# Altium project MAIN_BOARD.PrjPcb (part 2 of 3)

## Sheet RAIL_DISCHARGE.SchDoc
size A4; SheetNumber: 9; SheetTotal: 10
Used 3 times, as channels RAIL_DISCH_0, RAIL_DISCH_1, RAIL_DISCH_2. Parts and nets are listed once, with the designators drawn on the sheet.
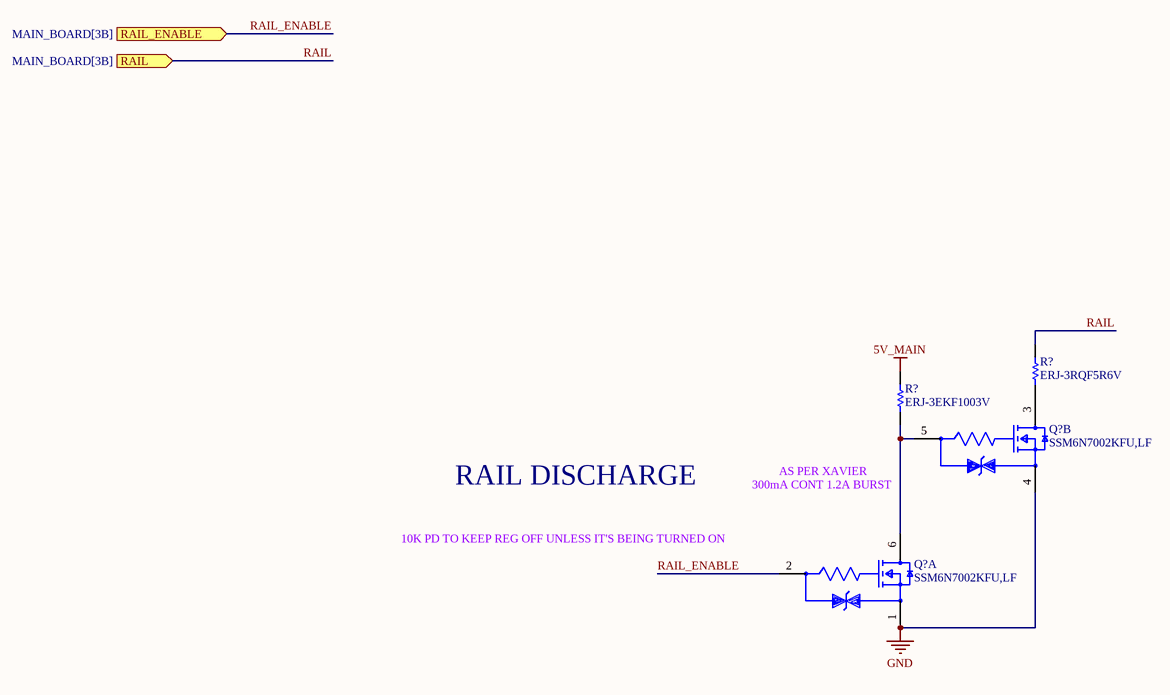
[diagram p11: RAIL_DISCHARGE.SchDoc]

### Parts
(Parts that share a designator on the sheet are numbered #1, #2 ... from top to bottom, then left to right.)
Q?#1  SSM6N7002KFU,LF  [FP-SSOP6-P-0_65A-MFG]  (part B of 2)
Q?#2  SSM6N7002KFU,LF  [FP-SSOP6-P-0_65A-MFG]  (part A of 2)
R?#1  ERJ-3RQF5R6V  [RESC1608X55X30LL15T15]
R?#2  ERJ-3EKF1003V  [RESC1608X55X30ML15T15]

### Ports
RAIL (in, see MAIN_BOARD[3B]), RAIL_ENABLE (in, see MAIN_BOARD[3B])

### Nets
5V_MAIN: R?#2.2
GND: Q?#1.4(Source2) Q?#2.1(Source1)
RAIL: R?#1.2 ; port RAIL
RAIL_ENABLE: Q?#2.2(Gate1) ; port RAIL_ENABLE
NetQ?#1_3: Q?#1.3(Drain2) R?#1.1
NetQ?#1_5: Q?#1.5(Gate2) Q?#2.6(Drain1) R?#2.1

### Channels
RAIL_DISCH_0: designators Q?=Q?_RAIL_DISCH_0#2 Q?=Q?_RAIL_DISCH_0#1 R?=R?_RAIL_DISCH_0#2 R?=R?_RAIL_DISCH_0#1; ports RAIL=RAIL_RAIL_DISCH_0 RAIL_ENABLE=RAIL_ENABLE_RAIL_DISCH_0
RAIL_DISCH_1: designators Q?=Q?_RAIL_DISCH_1#2 Q?=Q?_RAIL_DISCH_1#1 R?=R?_RAIL_DISCH_1#2 R?=R?_RAIL_DISCH_1#1; ports RAIL=RAIL RAIL_ENABLE=RAIL_ENABLE_RAIL_DISCH_1
RAIL_DISCH_2: designators Q?=Q?_RAIL_DISCH_2#2 Q?=Q?_RAIL_DISCH_2#1 R?=R?_RAIL_DISCH_2#2 R?=R?_RAIL_DISCH_2#1; ports RAIL=RAIL RAIL_ENABLE=RAIL_ENABLE_RAIL_DISCH_2

### Notes on the sheet
- RAIL DISCHARGE
- 300mA CONT 1.2A BURST
- AS PER XAVIER
- 10K PD TO KEEP REG OFF UNLESS IT'S BEING TURNED ON

### Library data of the parts
Q?#1 Q?#2 = CMP-35916-000009-1: MOSFET 2N-CH 60V 0.3A; Input Capacitance: 40pF; Continuous Drain Current (ID): 300mA; Max Power Dissipation: 285mW; FET Type: 2 N-Channel; Rds On Max: 1.5R; Mount: Surface Mount; Drain to Source Voltage (Vdss): 60V; Packaging: Tape and Reel
R?#1 = CMP-2000-00850-1: Manufacturer: Panasonic; Part Number: ERJ-3RQF5R6V
R?#2 = CMP-2000-00182-1: Manufacturer: Panasonic; Part Number: ERJ-3EKF1003V

## Sheet GMSL_DESERIALIZER.SchDoc
size C; SheetNumber: 6; SheetTotal: 11
Used 2 times, as channels DES_1, DES_0. Parts and nets are listed once, with the designators drawn on the sheet.
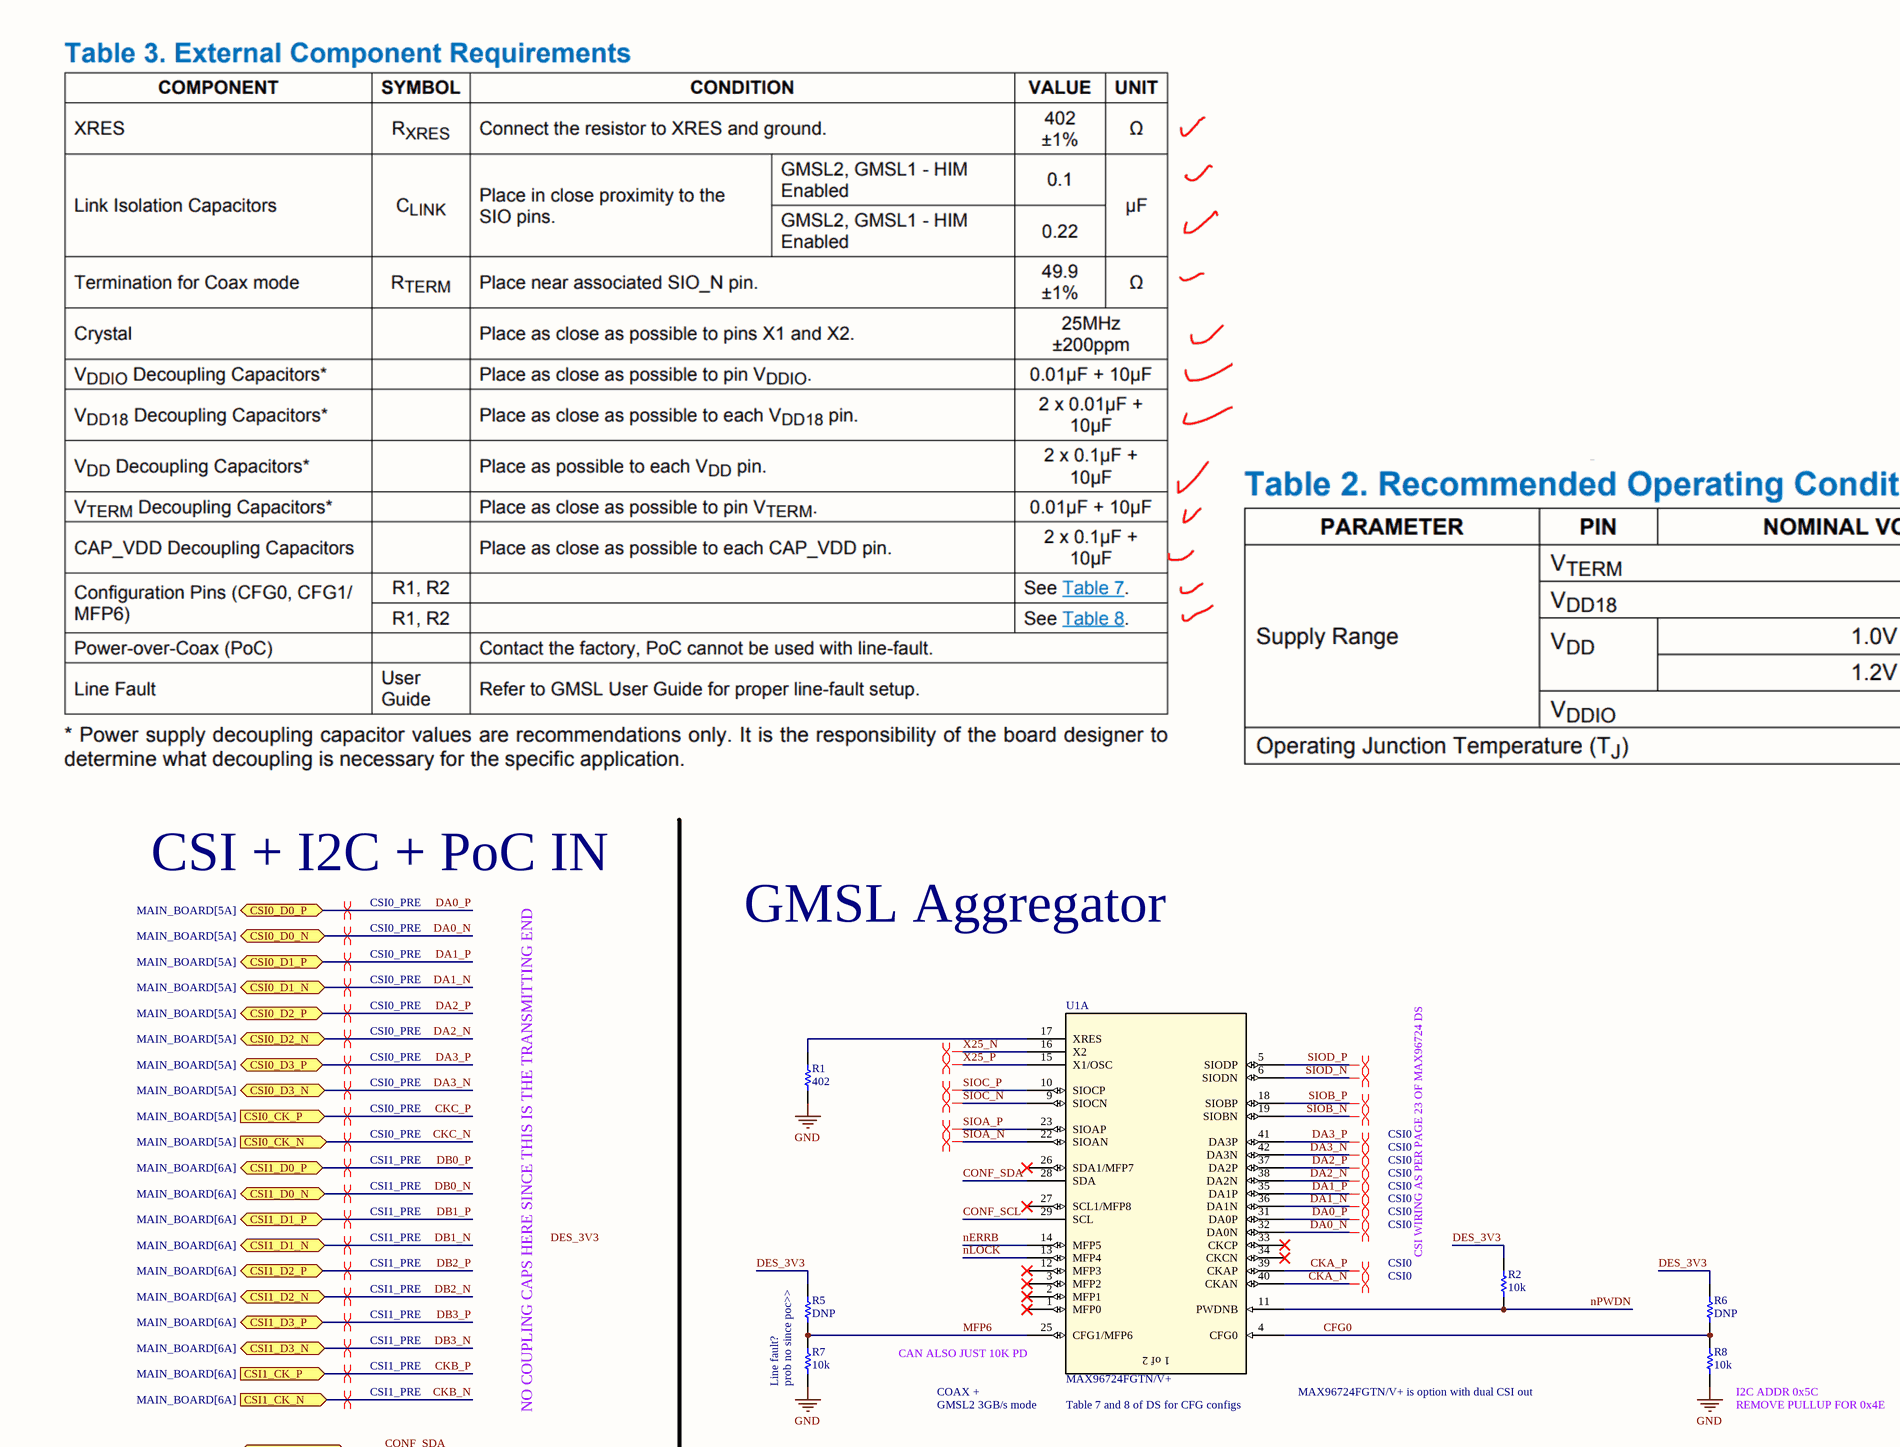
[diagram p12: GMSL_DESERIALIZER.SchDoc, top left]
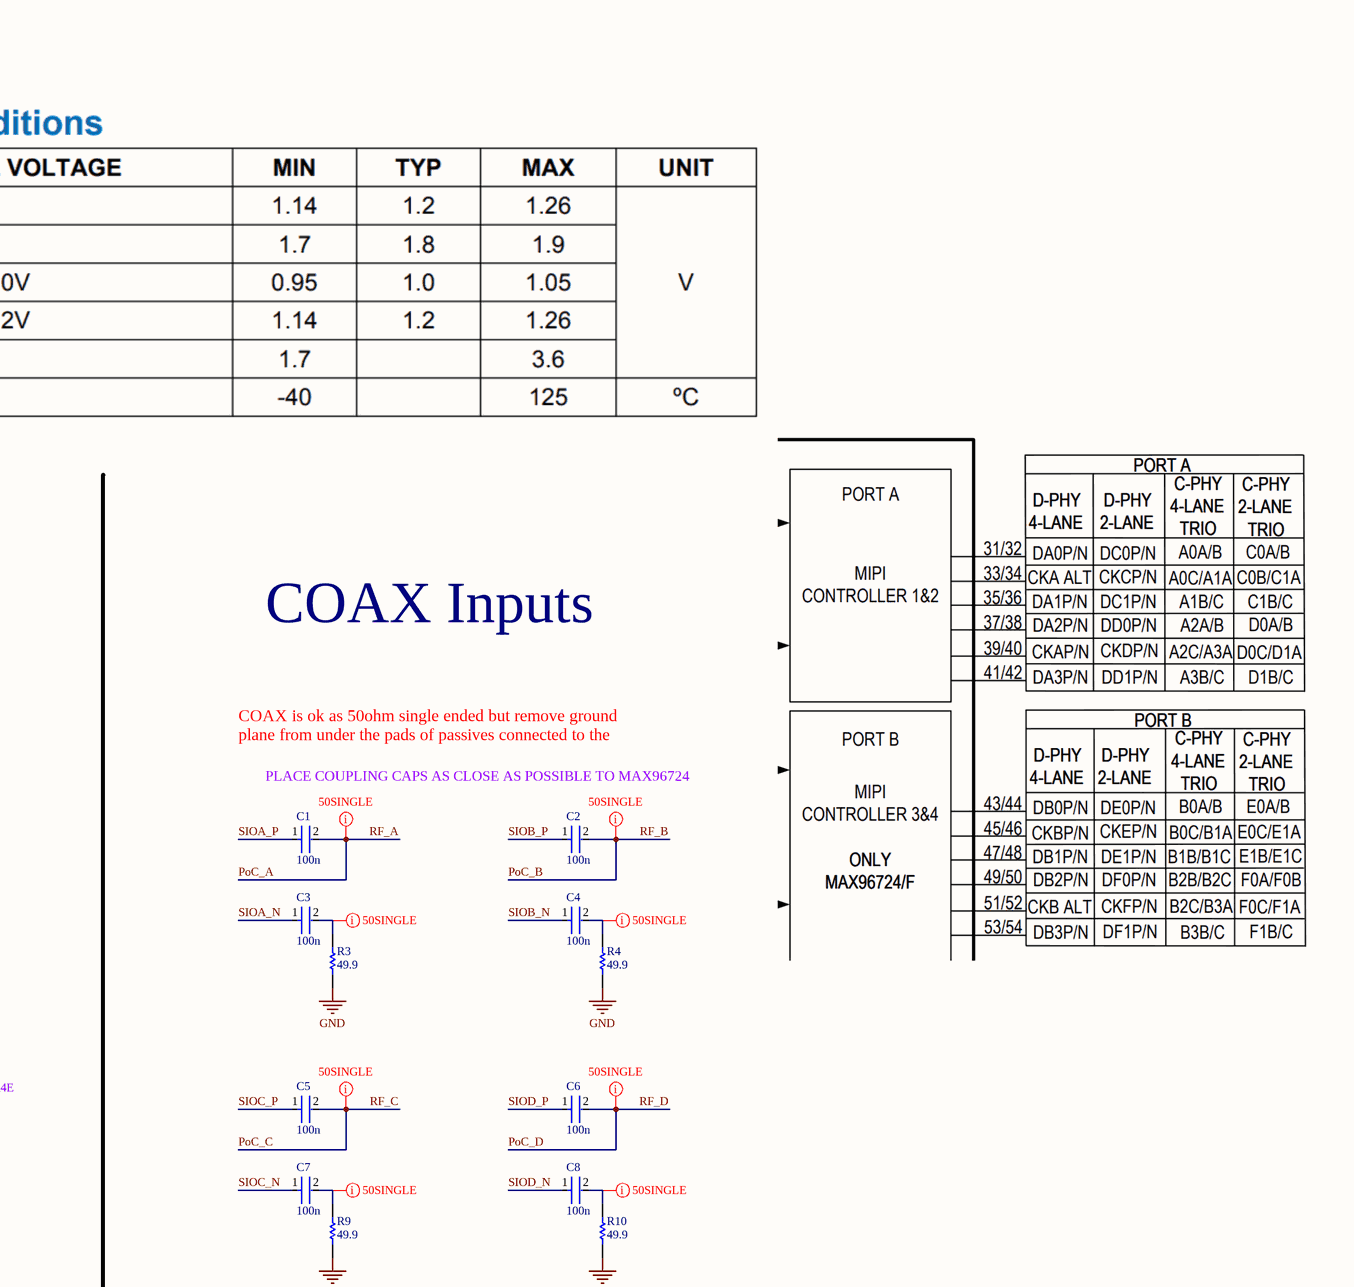
[diagram p13: GMSL_DESERIALIZER.SchDoc, top right]
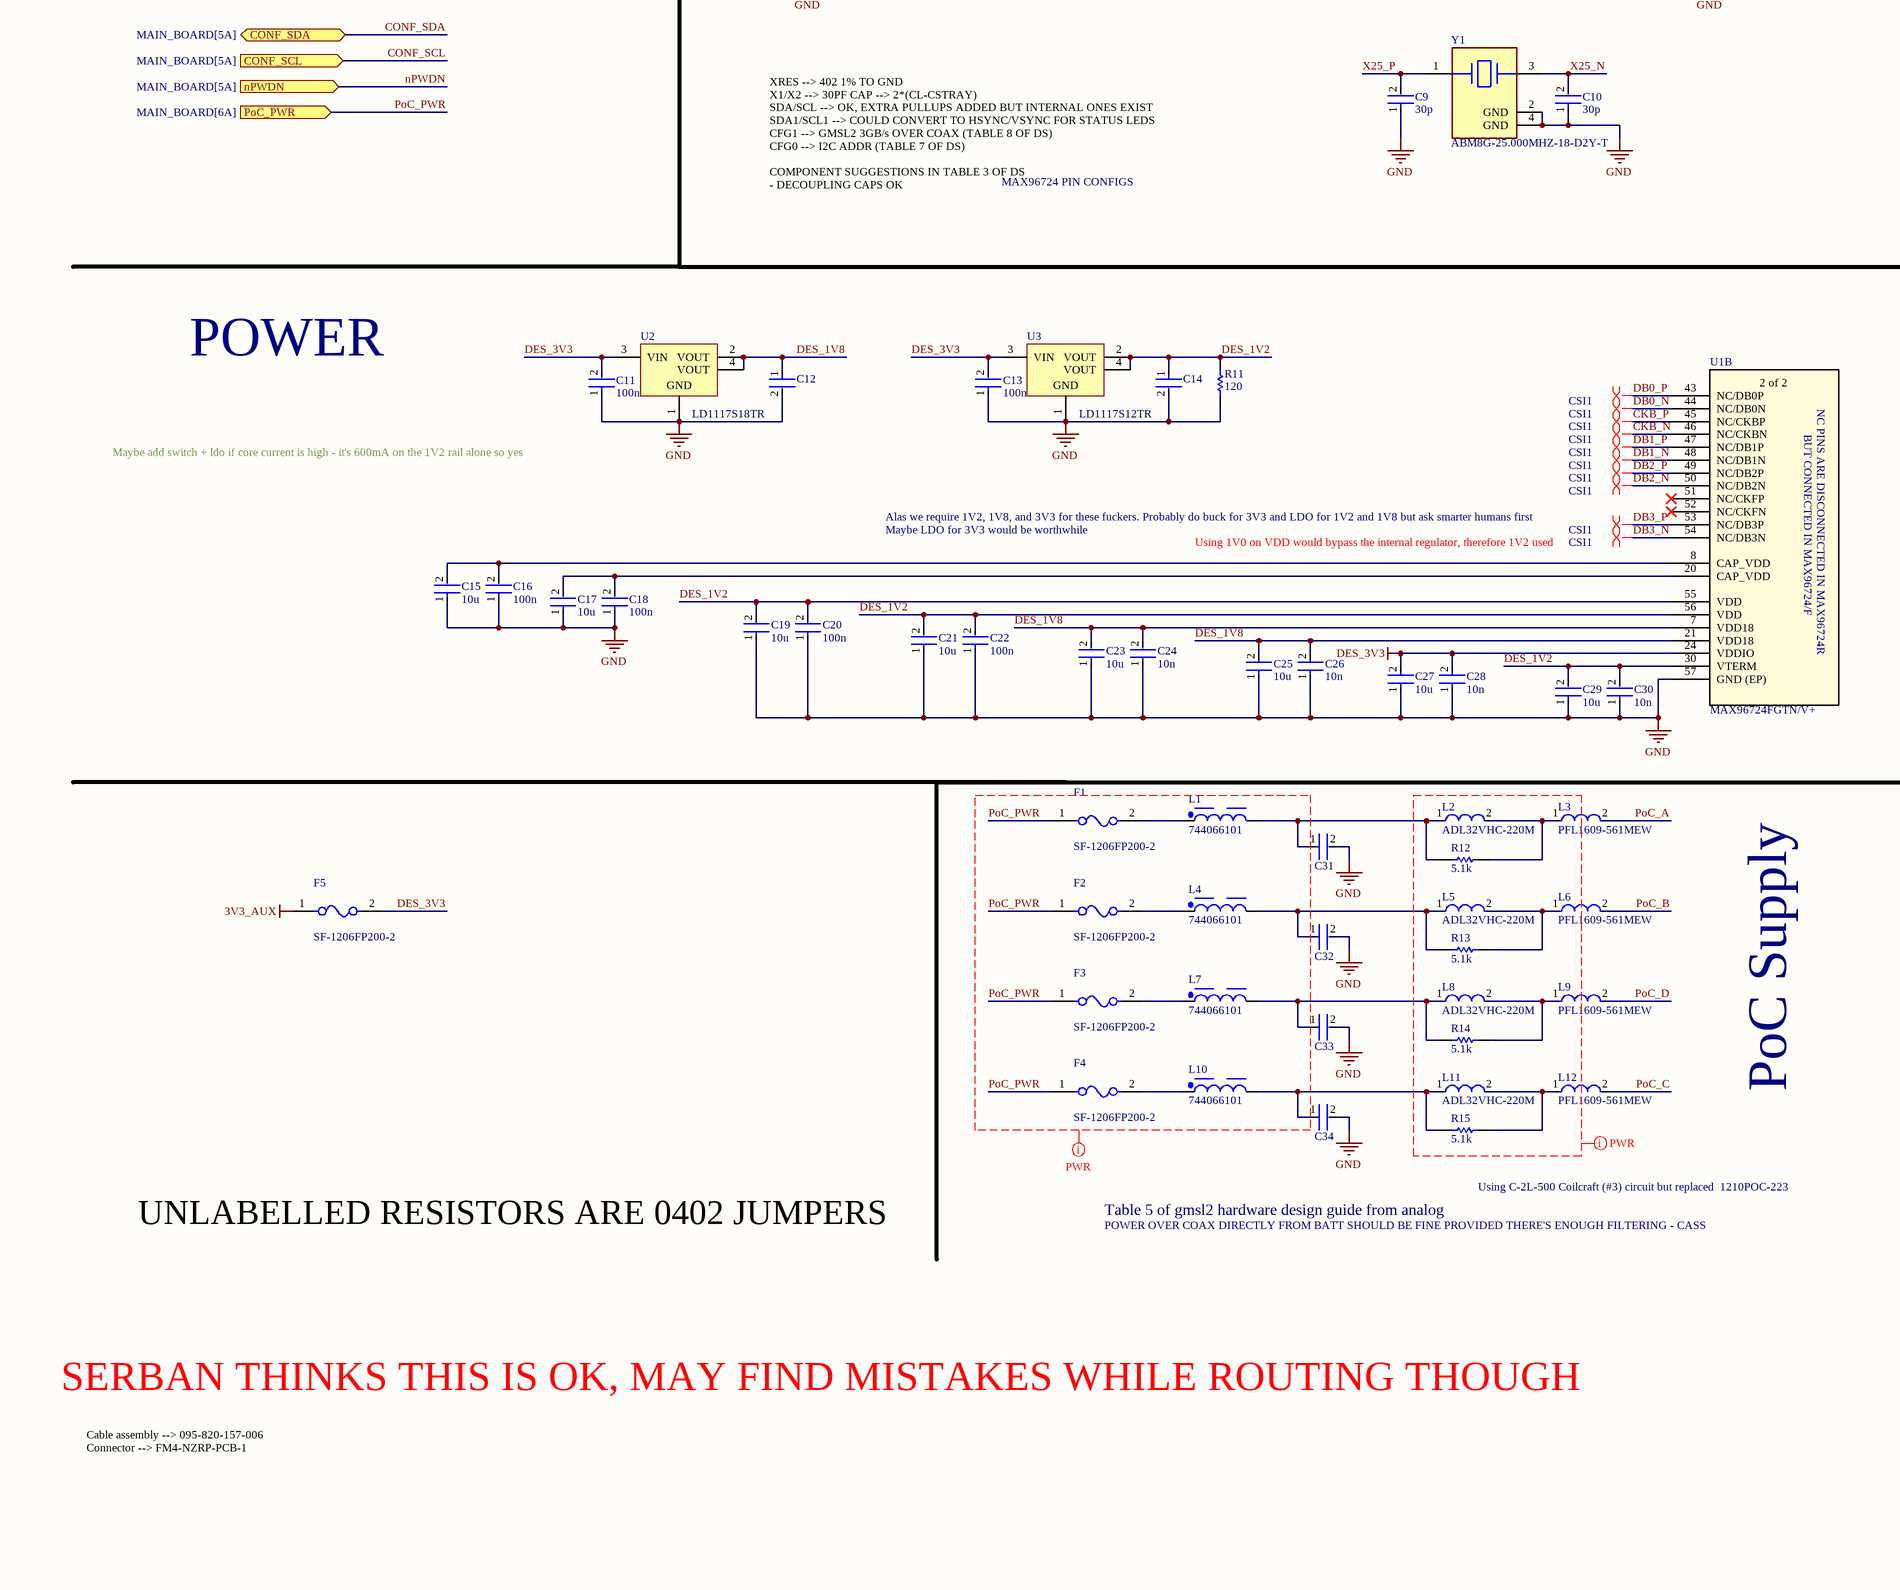
[diagram p14: GMSL_DESERIALIZER.SchDoc, bottom left]
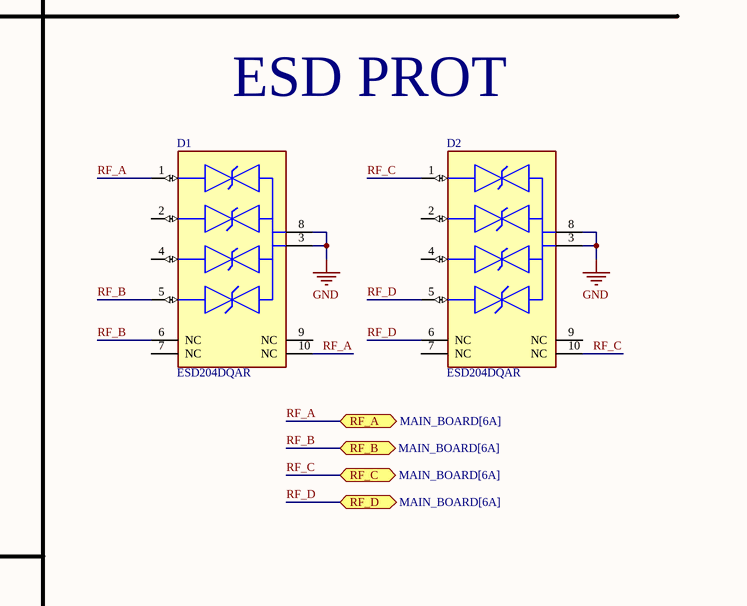
[diagram p15: GMSL_DESERIALIZER.SchDoc, bottom right]

### Parts
C1  100n  [FP-0402-L_1_0_0_05-W_0_5-IPC_A]
C2  100n  [FP-0402-L_1_0_0_05-W_0_5-IPC_A]
C3  100n  [FP-0402-L_1_0_0_05-W_0_5-IPC_A]
C4  100n  [FP-0402-L_1_0_0_05-W_0_5-IPC_A]
C5  100n  [FP-0402-L_1_0_0_05-W_0_5-IPC_A]
C6  100n  [FP-0402-L_1_0_0_05-W_0_5-IPC_A]
C7  100n  [FP-0402-L_1_0_0_05-W_0_5-IPC_A]
C8  100n  [FP-0402-L_1_0_0_05-W_0_5-IPC_A]
C9  30p  [FP-0402-L_1_0_0_05-W_0_5-IPC_A]
C10  30p  [FP-0402-L_1_0_0_05-W_0_5-IPC_A]
C11  100n  [FP-0402-L_1_0_0_05-W_0_5-IPC_A]
C12  GRM188R60J106ME47D  [FP-GRM188-0_1-e0_2_0_55-IPC_A]  (value not drawn)
C13  100n  [FP-0402-L_1_0_0_05-W_0_5-IPC_A]
C14  GRM188R60J106ME47D  [FP-GRM188-0_1-e0_2_0_55-IPC_A]  (value not drawn)
C15  10u  [FP-0402-L_1_0_0_05-W_0_5-IPC_A]
C16  100n  [FP-0402-L_1_0_0_05-W_0_5-IPC_A]
C17  10u  [FP-0402-L_1_0_0_05-W_0_5-IPC_A]
C18  100n  [FP-0402-L_1_0_0_05-W_0_5-IPC_A]
C19  10u  [FP-0402-L_1_0_0_05-W_0_5-IPC_A]
C20  100n  [FP-0402-L_1_0_0_05-W_0_5-IPC_A]
C21  10u  [FP-0402-L_1_0_0_05-W_0_5-IPC_A]
C22  100n  [FP-0402-L_1_0_0_05-W_0_5-IPC_A]
C23  10u  [FP-0402-L_1_0_0_05-W_0_5-IPC_A]
C24  10n  [FP-0402-L_1_0_0_05-W_0_5-IPC_A]
C25  10u  [FP-0402-L_1_0_0_05-W_0_5-IPC_A]
C26  10n  [FP-0402-L_1_0_0_05-W_0_5-IPC_A]
C27  10u  [FP-0402-L_1_0_0_05-W_0_5-IPC_A]
C28  10n  [FP-0402-L_1_0_0_05-W_0_5-IPC_A]
C29  10u  [FP-0402-L_1_0_0_05-W_0_5-IPC_A]
C30  10n  [FP-0402-L_1_0_0_05-W_0_5-IPC_A]
C31  GRM21BR61E226ME44L  [FP-GRM21B-0_2-e0_2_0_7-IPC_B]  (value not drawn)
C32  GRM21BR61E226ME44L  [FP-GRM21B-0_2-e0_2_0_7-IPC_B]  (value not drawn)
C33  GRM21BR61E226ME44L  [FP-GRM21B-0_2-e0_2_0_7-IPC_B]  (value not drawn)
C34  GRM21BR61E226ME44L  [FP-GRM21B-0_2-e0_2_0_7-IPC_B]  (value not drawn)
D1  ESD204DQAR  [FP-DQA0010A-MFG]
D2  ESD204DQAR  [FP-DQA0010A-MFG]
F1  SF-1206FP200-2  [FP-SF-1206FP-MFG]
F2  SF-1206FP200-2  [FP-SF-1206FP-MFG]
F3  SF-1206FP200-2  [FP-SF-1206FP-MFG]
F4  SF-1206FP200-2  [FP-SF-1206FP-MFG]
F5  SF-1206FP200-2  [FP-SF-1206FP-MFG]
L1  744066101  [WE-TPC_1038]
L2  ADL32VHC-220M  [FP-1210POC-MFG]
L3  PFL1609-561MEW  [FP-PFL1609-MFG]
L4  744066101  [WE-TPC_1038]
L5  ADL32VHC-220M  [FP-1210POC-MFG]
L6  PFL1609-561MEW  [FP-PFL1609-MFG]
L7  744066101  [WE-TPC_1038]
L8  ADL32VHC-220M  [FP-1210POC-MFG]
L9  PFL1609-561MEW  [FP-PFL1609-MFG]
L10  744066101  [WE-TPC_1038]
L11  ADL32VHC-220M  [FP-1210POC-MFG]
L12  PFL1609-561MEW  [FP-PFL1609-MFG]
R1  402  [R0603B]
R2  10k  [R0603B]
R3  49.9  [R0603B]
R4  49.9  [R0603B]
R5  DNP  [R0603B]
R6  DNP  [R0603B]
R7  10k  [R0603B]
R8  10k  [R0603B]
R9  49.9  [R0603B]
R10  49.9  [R0603B]
R11  120  [R0603B]
R12  5.1k  [R0603B]
R13  5.1k  [R0603B]
R14  5.1k  [R0603B]
R15  5.1k  [R0603B]
U1  MAX96724FGTN/V+  [MAX96724FGTN_V+-Footprint-1]  (parts A,B of 2)
U2  LD1117S18TR  [SOT-223_M]
U3  LD1117S12TR  [SOT-223_M]
Y1  ABM8G-25.000MHZ-18-D2Y-T  [FP-ABM8G-MFG]

### Ports
CONF_SCL (in, see MAIN_BOARD[5A]), CONF_SDA (bidir, see MAIN_BOARD[5A]), CSI0_CK_N (in, see MAIN_BOARD[5A]), CSI0_CK_P (in, see MAIN_BOARD[5A]), CSI0_D0_N (bidir, see MAIN_BOARD[5A]), CSI0_D0_P (bidir, see MAIN_BOARD[5A]), CSI0_D1_N (bidir, see MAIN_BOARD[5A]), CSI0_D1_P (bidir, see MAIN_BOARD[5A]), CSI0_D2_N (bidir, see MAIN_BOARD[5A]), CSI0_D2_P (bidir, see MAIN_BOARD[5A]), CSI0_D3_N (bidir, see MAIN_BOARD[5A]), CSI0_D3_P (bidir, see MAIN_BOARD[5A]), CSI1_CK_N (in, see MAIN_BOARD[6A]), CSI1_CK_P (in, see MAIN_BOARD[6A]), CSI1_D0_N (bidir, see MAIN_BOARD[6A]), CSI1_D0_P (bidir, see MAIN_BOARD[6A]), CSI1_D1_N (bidir, see MAIN_BOARD[6A]), CSI1_D1_P (bidir, see MAIN_BOARD[6A]), CSI1_D2_N (bidir, see MAIN_BOARD[6A]), CSI1_D2_P (bidir, see MAIN_BOARD[6A]), CSI1_D3_N (bidir, see MAIN_BOARD[6A]), CSI1_D3_P (bidir, see MAIN_BOARD[6A]), nPWDN (in, see MAIN_BOARD[5A]), PoC_PWR (in, see MAIN_BOARD[6A]), RF_A (bidir, see MAIN_BOARD[6A]), RF_B (bidir, see MAIN_BOARD[6A]), RF_C (bidir, see MAIN_BOARD[6A]), RF_D (bidir, see MAIN_BOARD[6A])

### Nets
3V3_AUX: F5.1
DES_3V3: C11.2 C13.2 C27.2 C28.2 F5.2 R2.2 R5.2 R6.2 U1.24(VDDIO) U2.3(VIN) U3.3(VIN)
GND: C9.1 C10.1 C11.1 C12.2 C13.1 C14.2 C15.1 C16.1 C17.1 C18.1 C19.1 C20.1 C21.1 C22.1 C23.1 C24.1 C25.1 C26.1 C27.1 C28.1 C29.1 C30.1 C31.2 C32.2 C33.2 C34.2 D1.3(GND) D1.8(GND) D2.3(GND) D2.8(GND) R1.1 R3.1 R4.1 R7.1 R8.1 R9.1 R10.1 R11.1 U1.57(GND_(EP)) U2.1(GND) U3.1(GND) Y1.2(GND) Y1.4(GND)
CFG0: R6.1 R8.2 U1.4(CFG0)
CKA_N: U1.40(CKAN)
CKA_P: U1.39(CKAP)
CKB_N: U1.46(NC/CKBN) ; port CSI1_CK_N
CKB_P: U1.45(NC/CKBP) ; port CSI1_CK_P
CKC_N: port CSI0_CK_N
CKC_P: port CSI0_CK_P
CONF_SCL: U1.29(SCL) ; port CONF_SCL
CONF_SDA: U1.28(SDA) ; port CONF_SDA
DA0_N: U1.32(DA0N) ; port CSI0_D0_N
DA0_P: U1.31(DA0P) ; port CSI0_D0_P
DA1_N: U1.36(DA1N) ; port CSI0_D1_N
DA1_P: U1.35(DA1P) ; port CSI0_D1_P
DA2_N: U1.38(DA2N) ; port CSI0_D2_N
DA2_P: U1.37(DA2P) ; port CSI0_D2_P
DA3_N: U1.42(DA3N) ; port CSI0_D3_N
DA3_P: U1.41(DA3P) ; port CSI0_D3_P
DB0_N: U1.44(NC/DB0N) ; port CSI1_D0_N
DB0_P: U1.43(NC/DB0P) ; port CSI1_D0_P
DB1_N: U1.48(NC/DB1N) ; port CSI1_D1_N
DB1_P: U1.47(NC/DB1P) ; port CSI1_D1_P
DB2_N: U1.50(NC/DB2N) ; port CSI1_D2_N
DB2_P: U1.49(NC/DB2P) ; port CSI1_D2_P
DB3_N: U1.54(NC/DB3N) ; port CSI1_D3_N
DB3_P: U1.53(NC/DB3P) ; port CSI1_D3_P
DES_1V2: C14.1 C19.2 C20.2 C21.2 C22.2 C29.2 C30.2 R11.2 U1.30(VTERM) U1.55(VDD) U1.56(VDD) U3.2(VOUT) U3.4(VOUT)
DES_1V8: C12.1 C23.2 C24.2 C25.2 C26.2 U1.7(VDD18) U1.21(VDD18) U2.2(VOUT) U2.4(VOUT)
MFP6: R5.1 R7.2 U1.25(CFG1/MFP6)
nERRB: U1.14(MFP5)
nLOCK: U1.13(MFP4)
nPWDN: R2.1 U1.11(PWDNB) ; port nPWDN
PoC_A: C1.2 D1.1(IO1) D1.10(NC) L3.2 ; port RF_A  [also labelled RF_A]
PoC_B: C2.2 D1.5(IO4) D1.6(NC) L6.2 ; port RF_B  [also labelled RF_B]
PoC_C: C5.2 D2.1(IO1) D2.10(NC) L12.2 ; port RF_C  [also labelled RF_C]
PoC_D: C6.2 D2.5(IO4) D2.6(NC) L9.2 ; port RF_D  [also labelled RF_D]
PoC_PWR: F1.1 F2.1 F3.1 F4.1 ; port PoC_PWR
SIOA_N: C3.1 U1.22(SIOAN)
SIOA_P: C1.1 U1.23(SIOAP)
SIOB_N: C4.1 U1.19(SIOBN)
SIOB_P: C2.1 U1.18(SIOBP)
SIOC_N: C7.1 U1.9(SIOCN)
SIOC_P: C5.1 U1.10(SIOCP)
SIOD_N: C8.1 U1.6(SIODN)
SIOD_P: C6.1 U1.5(SIODP)
X25_N: C10.2 U1.16(X2) Y1.3
X25_P: C9.2 U1.15(X1/OSC) Y1.1
NetC3_2: C3.2 R3.2
NetC4_2: C4.2 R4.2
NetC7_2: C7.2 R9.2
NetC8_2: C8.2 R10.2
NetC15_2: C15.2 C16.2 U1.8(CAP_VDD)
NetC17_2: C17.2 C18.2 U1.20(CAP_VDD)
NetC31_1: C31.1 L1.2 L2.1 R12.2
NetC32_1: C32.1 L4.2 L5.1 R13.2
NetC33_1: C33.1 L7.2 L8.1 R14.2
NetC34_1: C34.1 L10.2 L11.1 R15.2
NetF1_2: F1.2 L1.1
NetF2_2: F2.2 L4.1
NetF3_2: F3.2 L7.1
NetF4_2: F4.2 L10.1
NetL2_2: L2.2 L3.1 R12.1
NetL5_2: L5.2 L6.1 R13.1
NetL8_2: L8.2 L9.1 R14.1
NetL11_2: L11.2 L12.1 R15.1
NetR1_2: R1.2 U1.17(XRES)

Not connected (* = marked no-connect by the designer): D1 2(IO2) 4(IO3) 7(NC) 9(NC); D2 2(IO2) 4(IO3) 7(NC) 9(NC); U1 1(MFP0)* 2(MFP1)* 3(MFP2)* 12(MFP3)* 26(SDA1/MFP7)* 27(SCL1/MFP8)* 33(CKCP)* 34(CKCN)* 51(NC/CKFP)* 52(NC/CKFN)*

### Channels
DES_1: designators end in _DES_1; ports CONF_SCL=CONF_SCL_DES_1 CONF_SDA=CONF_SDA_DES_1 CSI0_CK_N=CKC_N_DES_1 CSI0_CK_P=CKC_P_DES_1 CSI0_D0_N=DA0_N_DES_1 CSI0_D0_P=DA0_P_DES_1 CSI0_D1_N=DA1_N_DES_1 CSI0_D1_P=DA1_P_DES_1 CSI0_D2_N=DA2_N_DES_1 CSI0_D2_P=DA2_P_DES_1 CSI0_D3_N=DA3_N_DES_1 CSI0_D3_P=DA3_P_DES_1 CSI1_CK_N=CKB_N_DES_1 CSI1_CK_P=CKB_P_DES_1 CSI1_D0_N=DB0_N_DES_1 CSI1_D0_P=DB0_P_DES_1 CSI1_D1_N=DB1_N_DES_1 CSI1_D1_P=DB1_P_DES_1 CSI1_D2_N=DB2_N_DES_1 CSI1_D2_P=DB2_P_DES_1 CSI1_D3_N=DB3_N_DES_1 CSI1_D3_P=DB3_P_DES_1 nPWDN=nPWDN_DES_1 PoC_PWR=PoC_PWR_DES_1 RF_A=PoC_A RF_B=PoC_B RF_C=PoC_C RF_D=PoC_D
DES_0: designators end in _DES_0; ports CONF_SCL=CONF_SCL_DES_0 CONF_SDA=CONF_SDA_DES_0 CSI0_CK_N=CKC_N_DES_0 CSI0_CK_P=CKC_P_DES_0 CSI0_D0_N=DA0_N_DES_0 CSI0_D0_P=DA0_P_DES_0 CSI0_D1_N=DA1_N_DES_0 CSI0_D1_P=DA1_P_DES_0 CSI0_D2_N=DA2_N_DES_0 CSI0_D2_P=DA2_P_DES_0 CSI0_D3_N=DA3_N_DES_0 CSI0_D3_P=DA3_P_DES_0 CSI1_CK_N=CKB_N_DES_0 CSI1_CK_P=CKB_P_DES_0 CSI1_D0_N=DB0_N_DES_0 CSI1_D0_P=DB0_P_DES_0 CSI1_D1_N=DB1_N_DES_0 CSI1_D1_P=DB1_P_DES_0 CSI1_D2_N=DB2_N_DES_0 CSI1_D2_P=DB2_P_DES_0 CSI1_D3_N=DB3_N_DES_0 CSI1_D3_P=DB3_P_DES_0 nPWDN=nPWDN_DES_0 PoC_PWR=PoC_PWR_DES_0 RF_A=PoC_A RF_B=PoC_B RF_C=PoC_C RF_D=PoC_D

### Layout directives
differential pair; differential pair class CSI0: CKA_N_DES_1, CKA_P_DES_1, DA0_N_DES_1, DA0_P_DES_1, DA1_N_DES_1, DA1_P_DES_1, DA2_N_DES_1, DA2_P_DES_1, DA3_N_DES_1, DA3_P_DES_1
differential pair; differential pair class 100DIFF: SIOA_N_DES_1, SIOA_P_DES_1, SIOB_N_DES_1, SIOB_P_DES_1, SIOC_N_DES_1, SIOC_P_DES_1, SIOD_N_DES_1, SIOD_P_DES_1
differential pair: X25_N_DES_1, X25_P_DES_1
differential pair; differential pair class CSI1: CKB_N_DES_1, CKB_P_DES_1, DB0_N_DES_1, DB0_P_DES_1, DB1_N_DES_1, DB1_P_DES_1, DB2_N_DES_1, DB2_P_DES_1, DB3_N_DES_1, DB3_P_DES_1
net class PWR: (no net found under the mark), PoC_PWR
differential pair; differential pair class CSI0_PRE: CKC_N_DES_1, CKC_P_DES_1, DA0_N_DES_1, DA0_P_DES_1, DA1_N_DES_1, DA1_P_DES_1, DA2_N_DES_1, DA2_P_DES_1, DA3_N_DES_1, DA3_P_DES_1
differential pair; differential pair class CSI1_PRE: CKB_N_DES_1, CKB_P_DES_1, DB0_N_DES_1, DB0_P_DES_1, DB1_N_DES_1, DB1_P_DES_1, DB2_N_DES_1, DB2_P_DES_1, DB3_N_DES_1, DB3_P_DES_1
net class 50SINGLE: NetC3_DES_1_2, NetC4_DES_1_2, NetC7_DES_1_2, NetC8_DES_1_2, PoC_A, PoC_B, PoC_C, PoC_D

### Notes on the sheet
- CSI + I2C + PoC IN
- GMSL Aggregator
- COAX Inputs
- COAX is ok as 50ohm single ended but remove ground plane from under the pads of passives connected to the GMSL trace
- PLACE COUPLING CAPS AS CLOSE AS POSSIBLE TO MAX96724
- CSI WIRING AS PER PAGE 23 OF MAX96724 DS
- Line fault?
- prob no since poc>>
- CAN ALSO JUST 10K PD
- NO COUPLING CAPS HERE SINCE THIS IS THE TRANSMITTING END
- GMSL2 3GB/s mode
- COAX +
- Table 7 and 8 of DS for CFG configs
- MAX96724FGTN/V+ is option with dual CSI out
- (near R8) I2C ADDR 0x5C
- (near R8) REMOVE PULLUP FOR 0x4E
- XRES --> 402 1% TO GND
  X1/X2 --> 30PF CAP --> 2*(CL-CSTRAY)
  SDA/SCL --> OK, EXTRA PULLUPS ADDED BUT INTERNAL ONES EXIST
  SDA1/SCL1 --> COULD CONVERT TO HSYNC/VSYNC FOR STATUS LEDS
  CFG1 --> GMSL2 3GB/s OVER COAX (TABLE 8 OF DS)
  CFG0 --> I2C ADDR (TABLE 7 OF DS)
  COMPONENT SUGGESTIONS IN TABLE 3 OF DS
  - DECOUPLING CAPS OK
- MAX96724 PIN CONFIGS
- ESD PROT
- POWER
- Maybe add switch + ldo if core current is high - it's 600mA on the 1V2 rail alone so yes
- Alas we require 1V2, 1V8, and 3V3 for these fuckers. Probably do buck for 3V3 and LDO for 1V2 and 1V8 but ask smarter humans first
- Maybe LDO for 3V3 would be worthwhile
- Using 1V0 on VDD would bypass the internal regulator, therefore 1V2 used
- PoC Supply
- Using C-2L-500 Coilcraft (#3) circuit but replaced  1210POC-223
- UNLABELLED RESISTORS ARE 0402 JUMPERS
- Table 5 of gmsl2 hardware design guide from analog
- POWER OVER COAX DIRECTLY FROM BATT SHOULD BE FINE PROVIDED THERE'S ENOUGH FILTERING - CASS
- SERBAN THINKS THIS IS OK, MAY FIND MISTAKES WHILE ROUTING THOUGH
- Cable assembly --> 095-820-157-006
  Connector --> FM4-NZRP-PCB-1
- Labels drawn without touching a wire or pin: DES_3V3
- (in symbol CMP-015-00011-2, part A) 1 of 2
- (in symbol CMP-015-00011-2, part B) 2 of 2; NC PINS ARE DISCONNECTED IN MAX96724R; BUT CONNECTED IN MAX96724/F

### Library data of the parts
C1-C11 C13 C15-C30 = CMP-001-00058-1: LARGE PADS, 0402 CAP, CHANGE COMMENT TO MATCH REAL P/N; Capacitor Type: Ceramic; Min Operating Temperature: -55°C; Mounting Technology: Surface Mount; Pins: 2; Case/Package: 0402; RoHS Compliant: Yes; Max Operating Temperature: 85°C
C12 C14 = CMP-2006-02792-2: Chip Multilayer Ceramic Capacitors for General Purpose, 0603, 10uF, X5R, 15%, 20%, 6.3V; Packaging: Tape and Reel; Voltage Rating (DC): 6.3V; Width: 0.031inch; Termination: SMD/SMT; Dielectric: X5R; Package Quantity: 4000; Voltage Rating: 6.3V; Capacitance: 10uF; Case/Package: 0603; Min Operating Temperature: -55°C; Voltage: 6.3V; Length: 1.6mm; Thickness: 0.035inch; Lead Free: Lead Free; Depth: 0.8mm; Case Code (Imperial): 0603; Max Operating Temperature: 85°C; Material: Ceramic; Height: 0.8mm; Tolerance: 20%; Mount: Surface Mount; REACH SVHC: No SVHC; Radiation Hardening: No; Case Code (Metric): 1608
C31-C34 = CMP-2007-03222-3: Chip Multilayer Ceramic Capacitors for General Purpose, 0805, 22uF, X5R, 15%, 20%, 25V; Case/Package: 0805; Depth: 1.25mm; Resistor Type: Ceramic; Voltage Rating: 25V; Lead Free: Lead Free; Voltage Rating (DC): 25V; Case Code (Metric): 2012; Thickness: 0.057inch; REACH SVHC: No SVHC; Material: Ceramic; Tolerance: 20%; Length: 2mm; Capacitance: 22uF; Case Code (Imperial): 0805; Max Operating Temperature: 85°C; Termination: SMD/SMT; Weight: 0.000335oz; Dielectric: X5R; Packaging: Tape and Reel; Voltage: 25V; Package Quantity: 3000; Height: 1.25mm; Mount: Surface Mount; Width: 1.25mm; Min Operating Temperature: -55°C
D1 D2 = CMP-04989-000002-1: 4-CHANNEL LOW-CAPACITANCE SURGE; Manufacturer: Texas Instruments; Value: 0.55pF; Reverse Standoff Voltage: 3.6V; Standoff Height: 0mm; Breakdown Voltage: 5.5V; Peak Pulse Current: 5.5A; Clamping Voltage: 11.5V; Direction: Bidirectional; Peak Pulse Power: 50W; Number Of Channels: 4; Ambient Temperature Range High: +125°C; ComponentLink2Description: Datasheet; Height: 0.55mm; Lead Free: Yes; Device Class L3: unset; Temperature Range High: +125°C; Temperature Range Low: -40°C; Package: DQA0010A; Temperature: -40°C to +125°C; Capacitance: 0.55pF; RoHS: TRUE; Mouser Description: 4-Channel Low-Capacitance Surge and ESD Protection Diode 10-USON -40 to 125; Category: Diode; Device Class L1: Circuit Protection; Octopart: https://octopart.com/esd204dqar-texas+instruments-89917476; Device Class L2: TVS Diodes; Ambient Temperature Range Low: -40°C; Manufacturer Part Number: ESD204DQAR; ComponentLink2URL: http://www.ti.com/lit/ds/symlink/esd204.pdf; Automotive: No; Digikey Description: 4-CHANNEL LOW-CAPACITANCE SURGE
F1-F5 = CMP-07399-000013-1: FUSE BOARD MOUNT 2A 63VDC 1206; Voltage Rating (DC): 63V; Fuse Type: Board Mount (Cartridge Style Excluded); Approvals: UL; Mount: Surface Mount; Min Operating Temperature: -20°C; Max Operating Temperature: 105°C; Case Code (Imperial): 1206; Packaging: Cut Tape; Current Rating: 2A; RoHS Compliant: Yes; Series: SinglFuse™ SF-1206FP; Case Code (Metric): 3216; Case/Package: 1206
L1 L4 L7 L10 = CMP-0227-00094-3: NexarPartId: 8917123; Current Rating: 1.2A; Shielding: Shielded; Core Material: Ferrite; Inductance: 100µH; Test Frequency: 100kHz; Tolerance: 30%; Resistance: 255mΩ; Self Resonant Frequency: 6MHz; Composition: Wirewound; Packaging: Cut Tape (CT); REACH SVHC: Unknown; Number of Pins: 2; Max DC Current: 1.2A; Saturation Current: 1.2A; Ambient Temperature Range High: 95°C; Weight: 1.273007g; Height: 3.8mm; Width: 10mm; Min Operating Temperature: -40°C; Max Operating Temperature: 125°C; Termination: SMD/SMT; Height - Seated (Max): 4.0894mm; Length: 10mm; RMS Current (Irms): 1.2A; Ambient Temperature Range Low: -40°C; RoHS: Compliant; Mount: Surface Mount; Depth: 10mm; DC Resistance (DCR): 255mΩ; Inductance Tolerance: 30%; Case/Package: Nonstandard
L2 L5 L8 L11 = CMP-11268-000041-1: NOT COILCRAFT - ACTUAL P# --> ADL32VHC-220M / - Power Injection Chokes for PoC; Manufacturer Part Number: 1210POC-223MRC; Value: 22uH; Core Material: Ferrite; Saturation Current: 720mA; Series Resistance: 0.88Ω; Rms Current: 700mA; Automotive Grade: Grade 1; Self Resonant Frequency: 70MHz; Test Frequency: 100kHz; Tolerance: 20%; Ambient Temperature Range High: +125°C; Manufacturer: coilcraft; Octopart: https://octopart.com/1210poc-223mrc-coilcraft-103207315; Category: Ind; Device Class L2: Inductors; RoHS: TRUE; Device Class L3: Fixed Inductors; Package: 1210POC; Ambient Temperature Range Low: -40°C; ComponentLink2URL: https://drive.google.com/open?id=15FlOq8Y4YbRFohfA_cJ40jgnqs8va2Mh; Lead Free: Yes; Inductance: 22uH; Device Class L1: Passive Components; ComponentLink2Description: Datasheet; Automotive: Yes; Height: 3mm
L3 L6 L9 L12 = CMP-11268-000007-1: Fixed Inductors PFL1609 Low Profile 0.56 uH 20 % 1.4 A; Manufacturer: coilcraft; Rms Current: 1100mA; Self Resonant Frequency: 600MHz; Core Material: Composite; Tolerance: 20%; Value: 0.56uH; Automotive Grade: Grade 1; Saturation Current: 710mA; Test Frequency: 7.9MHz; Shielding: true; Series Resistance: 130mΩ; Lead Free: Yes; Device Class L1: Passive Components; Package: PFL1609; Octopart: https://octopart.com/pfl1609-561mew-coilcraft-20329171; ComponentLink2URL: https://www.coilcraft.com/pdfs/pfl1609.pdf; Manufacturer Part Number: PFL1609-561MEW; Ambient Temperature Range Low: -40°C; Composition: Wirewound; Inductance: 0.56uH; Device Class L2: Inductors; Category: Ind; Device Class L3: Fixed Inductors; Mouser Description: Fixed Inductors PFL1609 Low Profile 0.56 uH 20 % 1.4 A; Automotive: Yes; ComponentLink2Description: Datasheet; Ambient Temperature Range High: +105°C; Height: 0.95mm; RoHS: TRUE
R1-R15 = CMP-009-00002-14: Resistor
U1 = CMP-015-00011-2: Quad Tunneling GMSL2/1 to CSI-2 Deserializer
U2 = CMP-0244-00308-1: Fixed Low Drop Positive Voltage Regulator, 1.8V, 4-Pin SOT-223, Tape and Reel; ComponentLink1URL: http://www.st.com; PackageReference: SOT-223; PackageDescription: 4-Pin SOT-223 Package, 6.5 x 3.5 mm Body, 2.3 mm Pitch, 7 mm Lead Span; ComponentLink2URL: http://www.st.com/internet/com/TECHNICAL_RESOURCES/TECHNICAL_LITERATURE/DATASHEET/CD00000544.pdf; ComponentLink2Description: Datasheet; ComponentLink1Description: Manufacturer URL; DatasheetVersion: 1/11/2011; PackageVersion: 2010
U3 = CMP-0244-00318-1: Fixed Low Drop Positive Voltage Regulator, 1.2V, 4-Pin SOT-223, Tape and Reel; PackageDescription: 4-Pin SOT-223 Package, 6.5 x 3.5 mm Body, 2.3 mm Pitch, 7 mm Lead Span; PackageVersion: 2010; ComponentLink2Description: Datasheet; PackageReference: SOT-223; ComponentLink2URL: http://www.st.com/internet/com/TECHNICAL_RESOURCES/TECHNICAL_LITERATURE/DATASHEET/CD00000544.pdf; ComponentLink1Description: Manufacturer URL; DatasheetVersion: 1/11/2011; ComponentLink1URL: http://www.st.com
Y1 = CMP-2000-05733-3: Crystal 25MHz ±20ppm (Tol) ±30ppm (Stability) 18pF FUND 60Ω 4-Pin SMD T/R; Series Resistance: 60R; Length: 3.2mm; Depth: 2.5mm; Packaging: Tape and Reel; Min Operating Temperature: -40°C; Operating Frequency: 25 MHz; Lead Free: Lead Free; Number of Pins: 4; Frequency Tolerance: 20ppm; Radiation Hardening: No; Max Operating Temperature: 85°C; Termination: SMD/SMT; Frequency Stability: 30ppm; Frequency: 25MHz; Series: ABM8G; Mount: Surface Mount; Package Quantity: 1000; Height: 0.039inch; Width: 0.098inch; Case/Package: CSMD; ESR (Equivalent Series Resistance): 60R; Load Capacitance: 18pF; Tolerance: 20ppm

## Sheet HDMI_TO_GMSL.SchDoc
size A4; SheetNumber: 10; SheetTotal: 12
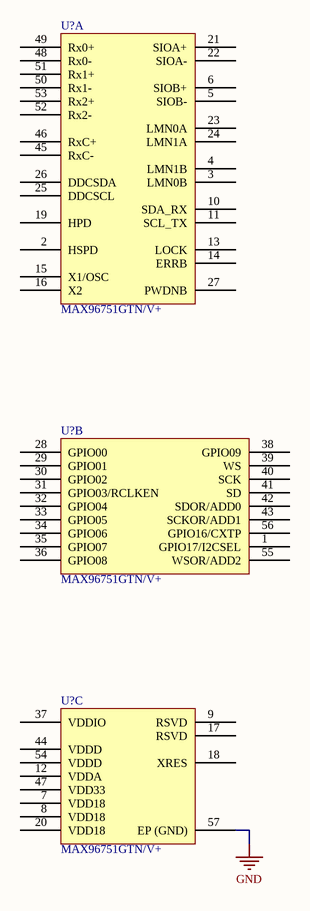
[diagram p16: HDMI_TO_GMSL.SchDoc]

### Parts
(Parts that share a designator on the sheet are numbered #1, #2 ... from top to bottom, then left to right.)
U?#6  MAX96751GTN/V+  [QFN50P800X800X80_HS-57N]  (part A of 3)
U?#7  MAX96751GTN/V+  [QFN50P800X800X80_HS-57N]  (part B of 3)
U?#8  MAX96751GTN/V+  [QFN50P800X800X80_HS-57N]  (part C of 3)

### Nets
GND: U?#8.57(EP_(GND))

Not connected (* = marked no-connect by the designer): U?#6 2(HSPD) 3(LMN0B) 4(LMN1B) 5(SIOB-) 6(SIOB+) 10(SDA_RX) 11(SCL_TX) 13(LOCK) 14(ERRB) 15(X1/OSC) 16(X2) 19(HPD) 21(SIOA+) 22(SIOA-) 23(LMN0A) 24(LMN1A) 25(DDCSCL) 26(DDCSDA) 27(PWDNB) 45(RxC-) 46(RxC+) 48(Rx0-) 49(Rx0+) 50(Rx1-) 51(Rx1+) 52(Rx2-) 53(Rx2+); U?#7 1(GPIO17/I2CSEL) 28(GPIO00) 29(GPIO01) 30(GPIO02) 31(GPIO03/RCLKEN) 32(GPIO04) 33(GPIO05) 34(GPIO06) 35(GPIO07) 36(GPIO08) 38(GPIO09) 39(WS) 40(SCK) 41(SD) 42(SDOR/ADD0) 43(SCKOR/ADD1) 55(WSOR/ADD2) 56(GPIO16/CXTP); U?#8 7(VDD18) 8(VDD18) 9(RSVD) 12(VDDA) 17(RSVD) 18(XRES) 20(VDD18) 37(VDDIO) 44(VDDD) 47(VDD33) 54(VDDD)

### Library data of the parts
U?#6-U?#8 = CMP-015-00018-1: GMSL2 Serializer with HDMI 2.0 Input

## Sheet HD3SS215_PINOUT.SchDoc
size C; SheetNumber: 11; SheetTotal: 14
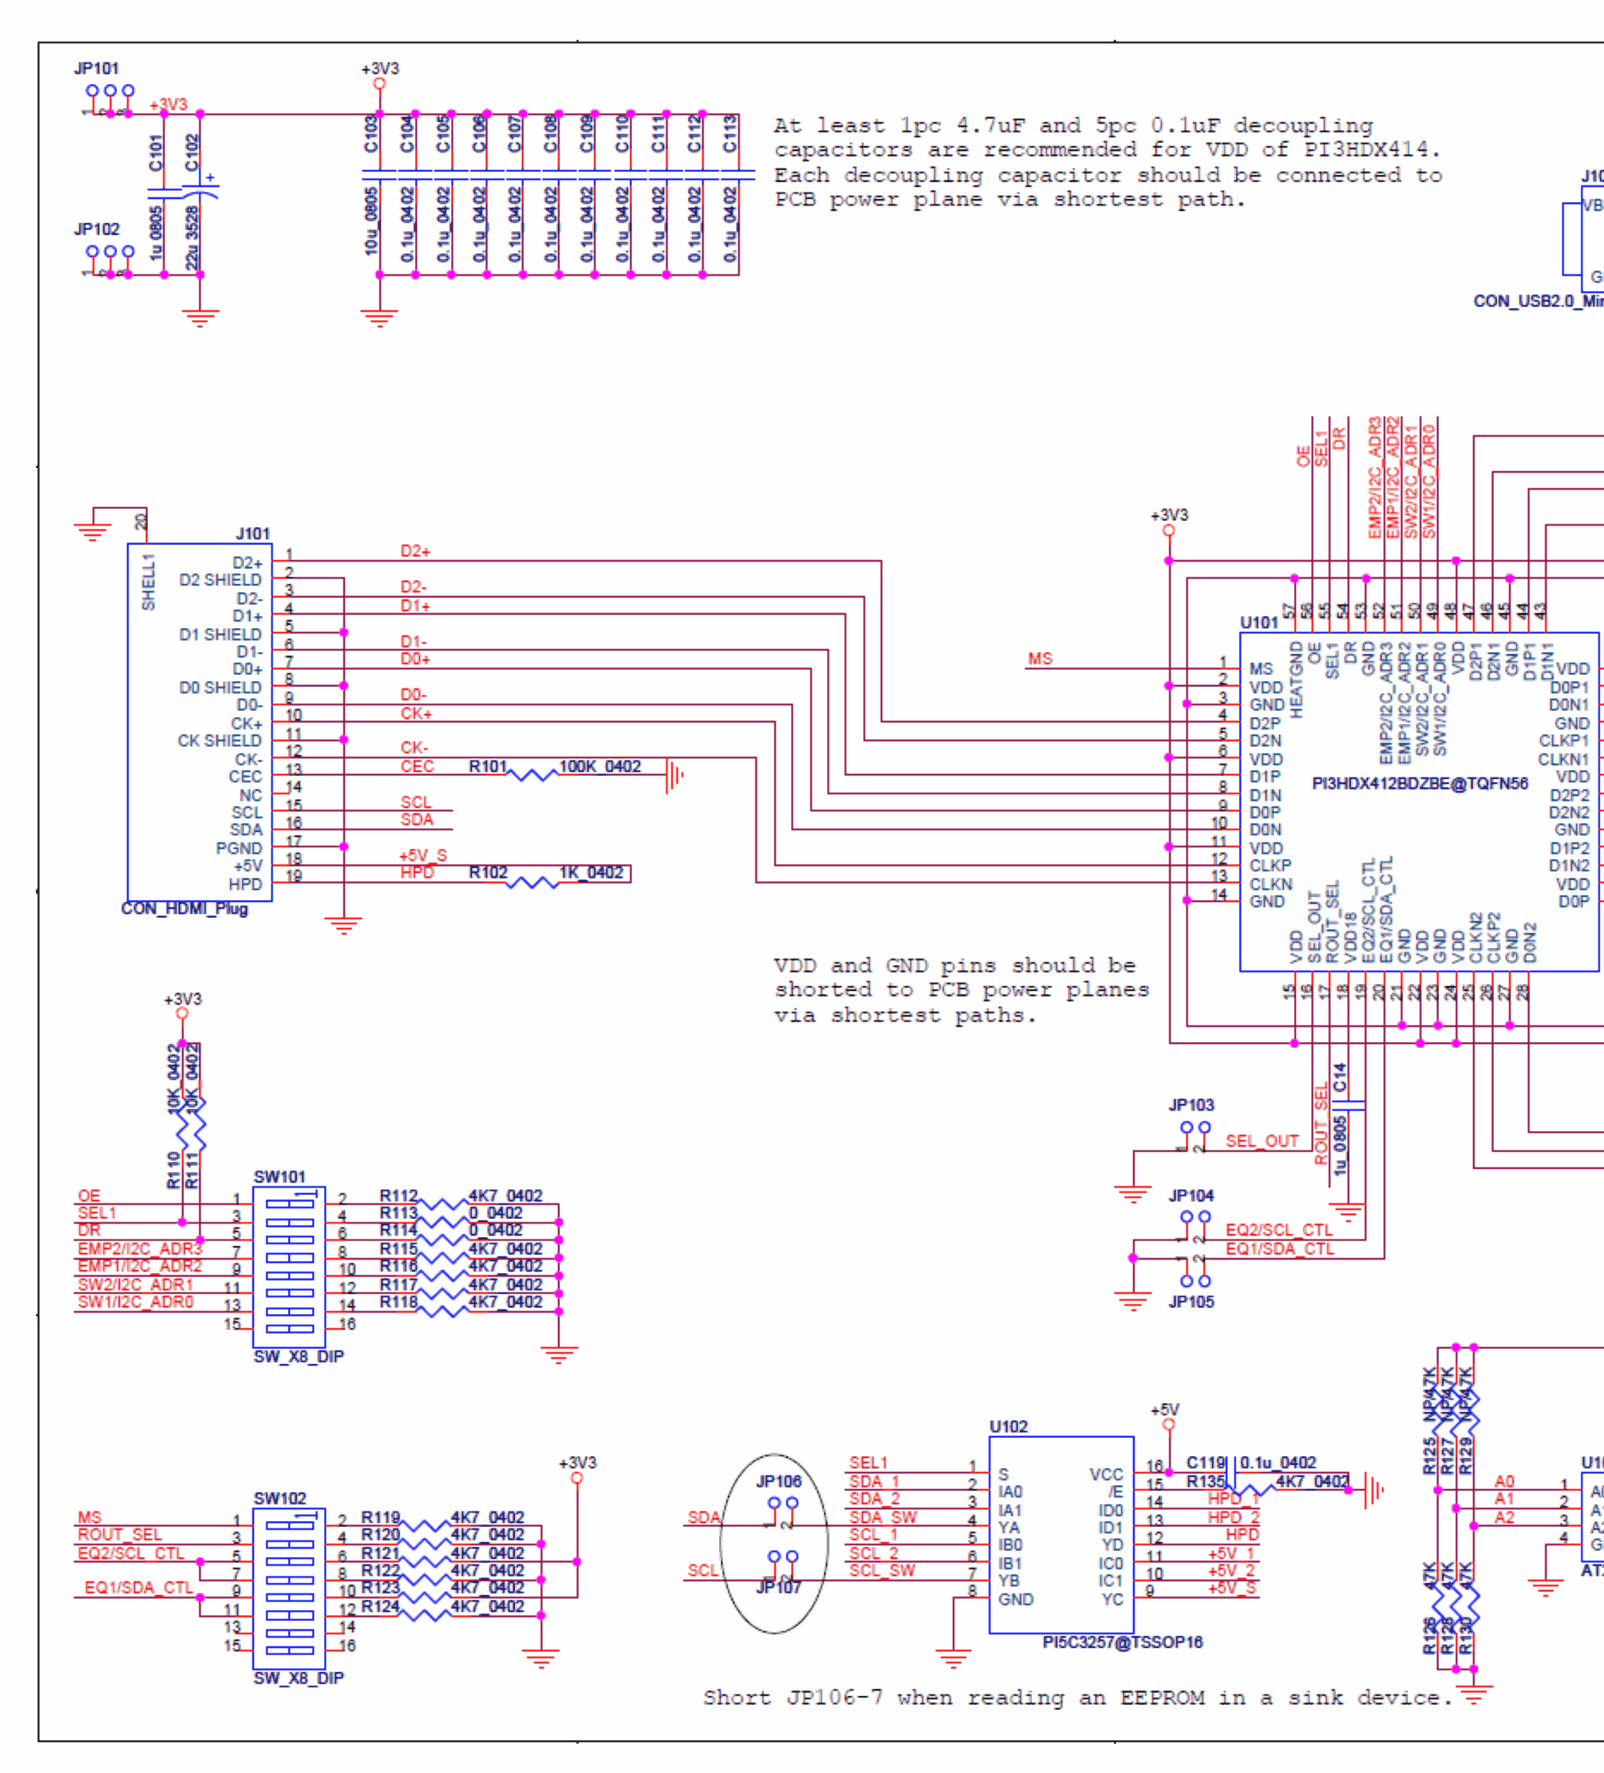
[diagram p17: HD3SS215_PINOUT.SchDoc, top left]
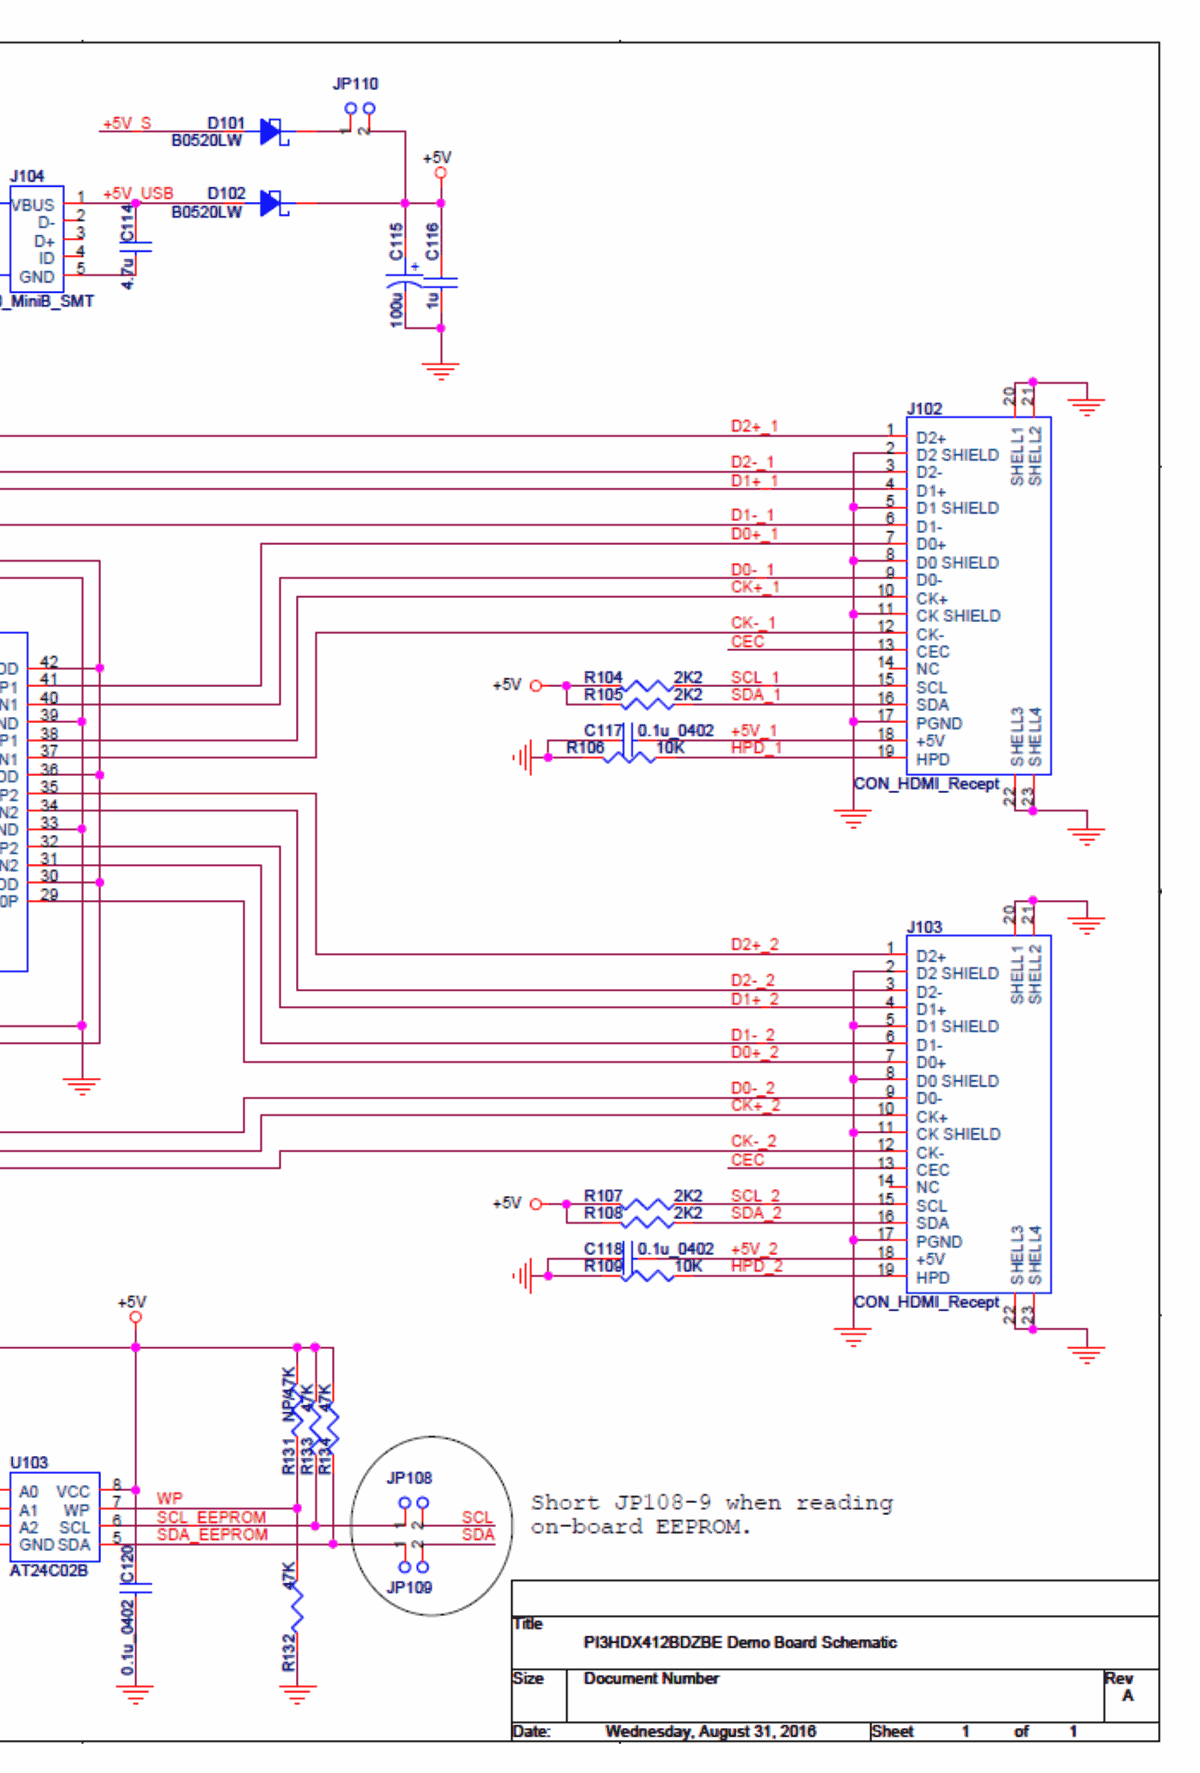
[diagram p18: HD3SS215_PINOUT.SchDoc, top right]
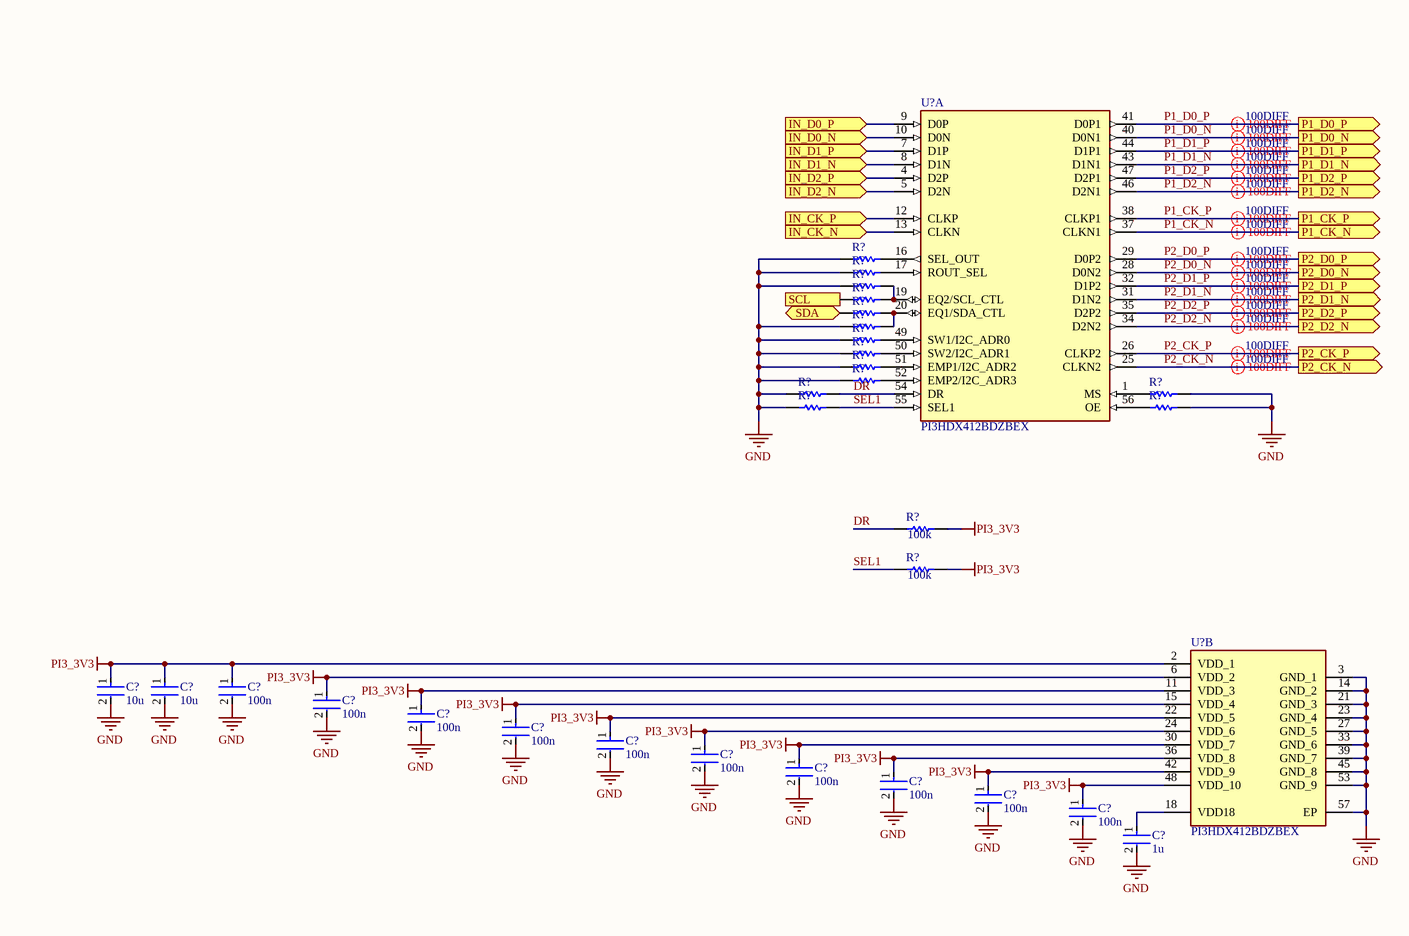
[diagram p19: HD3SS215_PINOUT.SchDoc, bottom left]

### Parts
(Parts that share a designator on the sheet are numbered #1, #2 ... from top to bottom, then left to right.)
C?#56  10u  [FP-0402-L_1_0_0_05-W_0_5-IPC_A]
C?#57  10u  [FP-0402-L_1_0_0_05-W_0_5-IPC_A]
C?#58  100n  [FP-0402-L_1_0_0_05-W_0_5-IPC_A]
C?#59  100n  [FP-0402-L_1_0_0_05-W_0_5-IPC_A]
C?#60  100n  [FP-0402-L_1_0_0_05-W_0_5-IPC_A]
C?#61  100n  [FP-0402-L_1_0_0_05-W_0_5-IPC_A]
C?#62  100n  [FP-0402-L_1_0_0_05-W_0_5-IPC_A]
C?#63  100n  [FP-0402-L_1_0_0_05-W_0_5-IPC_A]
C?#64  100n  [FP-0402-L_1_0_0_05-W_0_5-IPC_A]
C?#65  100n  [FP-0402-L_1_0_0_05-W_0_5-IPC_A]
C?#66  100n  [FP-0402-L_1_0_0_05-W_0_5-IPC_A]
C?#67  100n  [FP-0402-L_1_0_0_05-W_0_5-IPC_A]
C?#68  1u  [FP-0402-L_1_0_0_05-W_0_5-IPC_A]
R?#37  0402 JUMPER  [RESC1005X40X25ML05T05]  (value not drawn)
R?#38  0402 JUMPER  [RESC1005X40X25ML05T05]  (value not drawn)
R?#39  0402 JUMPER  [RESC1005X40X25ML05T05]  (value not drawn)
R?#40  0402 JUMPER  [RESC1005X40X25ML05T05]  (value not drawn)
R?#41  0402 JUMPER  [RESC1005X40X25ML05T05]  (value not drawn)
R?#42  0402 JUMPER  [RESC1005X40X25ML05T05]  (value not drawn)
R?#43  0402 JUMPER  [RESC1005X40X25ML05T05]  (value not drawn)
R?#44  0402 JUMPER  [RESC1005X40X25ML05T05]  (value not drawn)
R?#45  0402 JUMPER  [RESC1005X40X25ML05T05]  (value not drawn)
R?#46  0402 JUMPER  [RESC1005X40X25ML05T05]  (value not drawn)
R?#47  0402 JUMPER  [RESC1005X40X25ML05T05]  (value not drawn)
R?#48  DNP  [RESC1005X40X25ML05T05]  (value not drawn)
R?#49  0402 JUMPER  [RESC1005X40X25ML05T05]  (value not drawn)
R?#50  DNP  [RESC1005X40X25ML05T05]  (value not drawn)
R?#51  100k  [R0603B]
R?#52  100k  [R0603B]
U?#9  PI3HDX412BDZBEX  [QFN50P800X800X84_HS-57N]  (part A of 2)
U?#10  PI3HDX412BDZBEX  [QFN50P800X800X84_HS-57N]  (part B of 2)

### Ports
IN_CK_N (in), IN_CK_P (in), IN_D0_N (in), IN_D0_P (in), IN_D1_N (in), IN_D1_P (in), IN_D2_N (in), IN_D2_P (in), P1_CK_N (out), P1_CK_P (out), P1_D0_N (out), P1_D0_P (out), P1_D1_N (out), P1_D1_P (out), P1_D2_N (out), P1_D2_P (out), P2_CK_N (out), P2_CK_P (out), P2_D0_N (out), P2_D0_P (out), P2_D1_N (out), P2_D1_P (out), P2_D2_N (out), P2_D2_P (out), SCL (in), SDA (bidir)

### Nets
GND: C?#56.2 C?#57.2 C?#58.2 C?#59.2 C?#60.2 C?#61.2 C?#62.2 C?#63.2 C?#64.2 C?#65.2 C?#66.2 C?#67.2 C?#68.2 R?#37.1 R?#38.1 R?#39.1 R?#42.1 R?#43.1 R?#44.1 R?#45.1 R?#46.1 R?#47.1 R?#48.1 R?#49.1 R?#50.1 U?#10.3(GND_1) U?#10.14(GND_2) U?#10.21(GND_3) U?#10.23(GND_4) U?#10.27(GND_5) U?#10.33(GND_6) U?#10.39(GND_7) U?#10.45(GND_8) U?#10.53(GND_9) U?#10.57(EP)
PI3_3V3: C?#56.1 C?#57.1 C?#58.1 C?#59.1 C?#60.1 C?#61.1 C?#62.1 C?#63.1 C?#64.1 C?#65.1 C?#66.1 C?#67.1 R?#51.1 R?#52.1 U?#10.2(VDD_1) U?#10.6(VDD_2) U?#10.11(VDD_3) U?#10.15(VDD_4) U?#10.22(VDD_5) U?#10.24(VDD_6) U?#10.30(VDD_7) U?#10.36(VDD_8) U?#10.42(VDD_9) U?#10.48(VDD_10)
DR: R?#47.2 R?#51.2 U?#9.54(DR)
P1_CK_N: U?#9.37(CLKN1) ; port P1_CK_N
P1_CK_P: U?#9.38(CLKP1) ; port P1_CK_P
P1_D0_N: U?#9.40(D0N1) ; port P1_D0_N
P1_D0_P: U?#9.41(D0P1) ; port P1_D0_P
P1_D1_N: U?#9.43(D1N1) ; port P1_D1_N
P1_D1_P: U?#9.44(D1P1) ; port P1_D1_P
P1_D2_N: U?#9.46(D2N1) ; port P1_D2_N
P1_D2_P: U?#9.47(D2P1) ; port P1_D2_P
P2_CK_N: U?#9.25(CLKN2) ; port P2_CK_N
P2_CK_P: U?#9.26(CLKP2) ; port P2_CK_P
P2_D0_N: U?#9.28(D0N2) ; port P2_D0_N
P2_D0_P: U?#9.29(D0P2) ; port P2_D0_P
P2_D1_N: U?#9.31(D1N2) ; port P2_D1_N
P2_D1_P: U?#9.32(D1P2) ; port P2_D1_P
P2_D2_N: U?#9.34(D2N2) ; port P2_D2_N
P2_D2_P: U?#9.35(D2P2) ; port P2_D2_P
SEL1: R?#48.2 R?#52.2 U?#9.55(SEL1)
NetC?#68_1: C?#68.1 U?#10.18(VDD18)
NetR?#37_2: R?#37.2 U?#9.16(SEL_OUT)
NetR?#38_2: R?#38.2 U?#9.17(ROUT_SEL)
NetR?#39_2: R?#39.2 R?#40.2 U?#9.19(EQ2/SCL_CTL)
NetR?#40_1: R?#40.1 ; port SCL
NetR?#41_1: R?#41.1 ; port SDA
NetR?#41_2: R?#41.2 R?#42.2 U?#9.20(EQ1/SDA_CTL)
NetR?#43_2: R?#43.2 U?#9.49(SW1/I2C_ADR0)
NetR?#44_2: R?#44.2 U?#9.50(SW2/I2C_ADR1)
NetR?#45_2: R?#45.2 U?#9.51(EMP1/I2C_ADR2)
NetR?#46_2: R?#46.2 U?#9.52(EMP2/I2C_ADR3)
NetR?#49_2: R?#49.2 U?#9.1(MS)
NetR?#50_2: R?#50.2 U?#9.56(OE)
NetU?#9_4: U?#9.4(D2P) ; port IN_D2_P
NetU?#9_5: U?#9.5(D2N) ; port IN_D2_N
NetU?#9_7: U?#9.7(D1P) ; port IN_D1_P
NetU?#9_8: U?#9.8(D1N) ; port IN_D1_N
NetU?#9_9: U?#9.9(D0P) ; port IN_D0_P
NetU?#9_10: U?#9.10(D0N) ; port IN_D0_N
NetU?#9_12: U?#9.12(CLKP) ; port IN_CK_P
NetU?#9_13: U?#9.13(CLKN) ; port IN_CK_N

### Layout directives
differential pair; differential pair class 100DIFF: P1_CK_N, P1_CK_P, P1_D0_N, P1_D0_P, P1_D1_N, P1_D1_P, P1_D2_N, P1_D2_P, P2_CK_N, P2_CK_P, P2_D0_N, P2_D0_P, P2_D1_N, P2_D1_P, P2_D2_N, P2_D2_P

### Library data of the parts
C?#56-C?#68 = CMP-001-00058-1: as C1-C11 on sheet GMSL_DESERIALIZER; Min Operating Temperature: -55°C; Mounting Technology: Surface Mount; Pins: 2; Case/Package: 0402; RoHS Compliant: Yes; Max Operating Temperature: 85°C
R?#37-R?#50 = CMP-009-00118-2: READ THE NAME; Pins: 2; Component Type: Standard; Design Item ID: CMP-009-00206-2; Source: 0402jump.SchLib
R?#51 R?#52 = CMP-009-00002-14: Resistor
U?#9 U?#10 = CMP-015-00020-1: Analog Multiplexer Single 1: 2 56-Pin TQFN EP T/R / IC HDMI SW 1: 2 1.4B 56TQFN; Min Supply Voltage: 3V; Max Supply Voltage: 3.6V; Max Operating Temperature: 85°C; Mounting Technology: Surface Mount; Min Operating Temperature: -40°C; Pins: 56